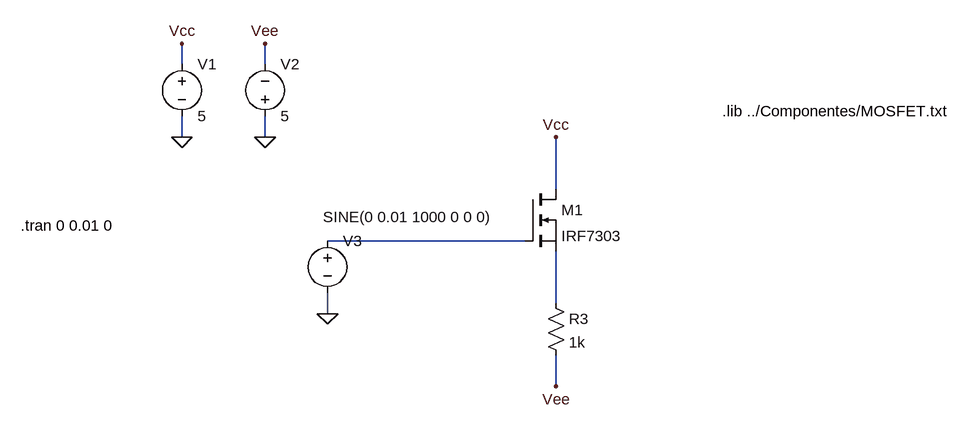
[diagram p0: schematic seguidor.asc]
seguidor.asc, the LTspice schematic file:
Version 4
SHEET 1 1252 828
WIRE -640 -80 -640 -112
WIRE -512 -80 -512 -112
WIRE -640 32 -640 0
WIRE -512 32 -512 0
WIRE -64 112 -64 32
WIRE -112 192 -416 192
WIRE -64 288 -64 208
WIRE -416 304 -416 272
WIRE -64 416 -64 368
FLAG -640 32 0
FLAG -512 32 0
FLAG -640 -112 Vcc
FLAG -512 -112 Vee
FLAG -64 32 Vcc
FLAG -416 304 0
FLAG -64 416 Vee
SYMBOL voltage -640 -96 R0
WINDOW 123 0 0 Left 2
WINDOW 39 0 0 Left 2
SYMATTR InstName V1
SYMATTR Value 5
SYMBOL voltage -512 16 M180
WINDOW 0 24 96 Left 2
WINDOW 3 24 16 Left 2
WINDOW 123 0 0 Left 2
WINDOW 39 0 0 Left 2
SYMATTR InstName V2
SYMATTR Value 5
SYMBOL voltage -416 176 R0
WINDOW 3 -7 -21 Left 2
WINDOW 123 0 0 Left 2
WINDOW 39 0 0 Left 2
SYMATTR Value SINE(0 0.01 1000 0 0 0)
SYMATTR InstName V3
SYMBOL nmos -112 112 R0
SYMATTR InstName M1
SYMATTR Value IRF7303
SYMBOL res -80 272 R0
SYMATTR InstName R3
SYMATTR Value 1k
TEXT -888 168 Left 2 !.tran 0 0.01 0
TEXT 192 -8 Left 2 !.lib ../Componentes/MOSFET.txt

The netlist it stands for:
* seguidor.asc
V1 Vcc 0 5
V2 0 Vee 5
V3 N001 0 SINE(0 0.01 1000 0 0 0)
M1 Vcc N001 N002 N002 IRF7303
R3 N002 Vee 1k
.model NMOS NMOS
.model PMOS PMOS
.lib standard.mos
.tran 0 0.01 0
.lib ../Componentes/MOSFET.txt
.backanno
.end